# Altium schematic sheet MAGI'sPicoPower.SchDoc
size A4
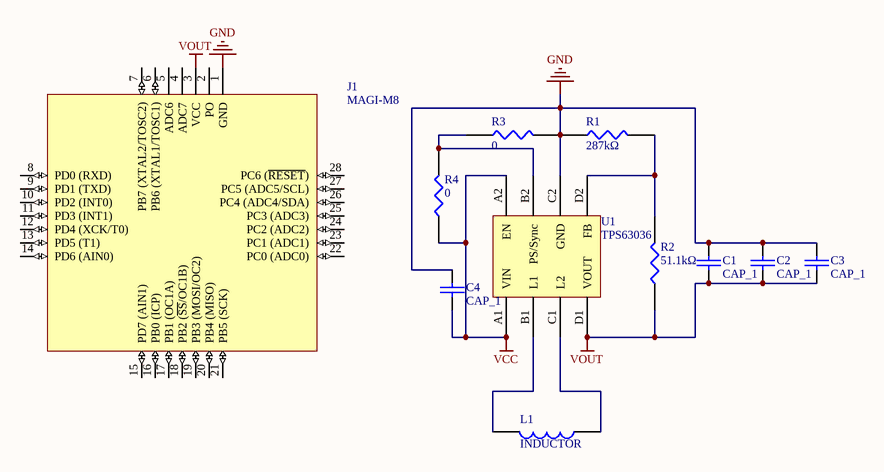
[diagram p0: MAGI'sPicoPower.SchDoc]

## Parts
C1  CAP_1  [6-0805_L]
C2  CAP_1  [6-0805_L]
C3  CAP_1  [6-0805_L]
C4  CAP_1  [6-0805_L]
J1  MAGI-M8  [MAGI-M8]
L1  INDUCTOR  [4*4]
R1  287kΩ  [6-0805_L]
R2  51.1kΩ  [6-0805_L]
R3  0  [1608[0603]]
R4  0  [1608[0603]]
U1  TPS63036  [WCSP-8]

## Nets
GND: C1.1 C2.1 C3.1 C4.1 J1.1(GND) R1.1 R3.2 U1.C2(GND)
VCC: C4.2 R4.1 U1.A1(VIN) U1.A2(EN)
VOUT: C1.2 C2.2 C3.2 J1.3(VCC) R2.1 U1.D1(VOUT)
NetL1_1: L1.1 U1.C1(L2)
NetL1_2: L1.2 U1.B1(L1)
NetR1_2: R1.2 R2.2 U1.D2(FB)
NetR3_1: R3.1 R4.2 U1.B2(PS/Sync)

Not connected (* = marked no-connect by the designer): J1 2(PO) 4(ADC7) 5(ADC6) 6(PB6_(XTAL1/TOSC1)) 7(PB7_(XTAL2/TOSC2)) 8(PD0_(RXD)) 9(PD1_(TXD)) 10(PD2_(INT0)) 11(PD3_(INT1)) 12(PD4_(XCK/T0)) 13(PD5_(T1)) 14(PD6_(AIN0)) 15(PD7_(AIN1)) 16(PB0_(ICP)) 17(PB1_(OC1A)) 18(PB2_(~{SS}/OC1B)) 19(PB3_(MOSI/OC2)) 20(PB4_(MISO)) 21(PB5_(SCK)) 22(PC0_(ADC0)) 23(PC1_(ADC1)) 24(PC2_(ADC2)) 25(PC3_(ADC3)) 26(PC4_(ADC4/SDA)) 27(PC5_(ADC5/SCL)) 28(PC6_(~{RESET}))

## Library data of the parts
C1-C4 = CAP_1: Capacitor
R1-R4 = RES1